# Altium schematic sheet 显示模块.SchDoc: RC1562L
size A4; Organization: 广东工程职业技术学院; Address1: 邹睿燮; Address2: 4****************9; Address3: 1905420313; SheetNumber: 4; SheetTotal: 4
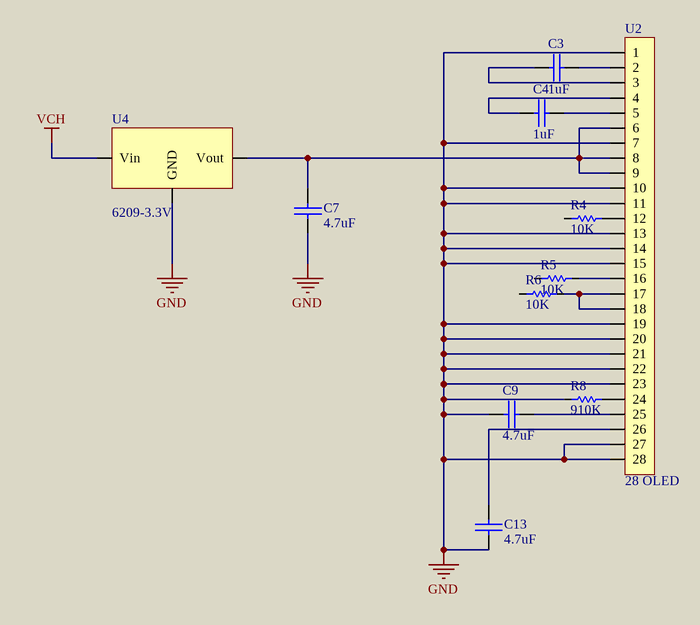
[diagram p0: 显示模块.SchDoc]

## Parts
C3  1uF  [6-0805_L]
C4  1uF  [6-0805_L]
C7  4.7uF  [6-0805_L]
C9  4.7uF  [6-0805_L]
C13  4.7uF  [6-0805_L]
R4  10K  [6-0805_L]
R5  10K  [6-0805_L]
R6  10K  [6-0805_L]
R8  910K  [6-0805_L]
U2  28 OLED  [28OLED]
U4  6209-3.3V  [SOT-23]

## Nets
GND: C7.1 C9.2 C13.2 R8.1 U2.1 U2.7 U2.10 U2.11 U2.13 U2.14 U2.15 U2.19 U2.20 U2.21 U2.22 U2.23 U2.27 U2.28 U4.1(GND)
VCH: U4.3(Vin)
NetC3_1: C3.1 U2.3
NetC3_2: C3.2 U2.2
NetC4_1: C4.1 U2.4
NetC4_2: C4.2 U2.5
NetC7_2: C7.2 U2.6 U2.8 U2.9 U4.2(Vout)
NetC9_1: C9.1 U2.25
NetC13_1: C13.1 U2.26
NetR4_2: R4.2 U2.12
NetR5_2: R5.2 U2.16
NetR6_2: R6.2 U2.17 U2.18
NetR8_2: R8.2 U2.24

Not connected (* = marked no-connect by the designer): R4 1; R5 1; R6 1

## Notes on the sheet
- 单位名称
- 考生信息
- 图名
- 文件名
- 第
- 幅
- 总共
- 当前日期
- 当前时间

## Library data of the parts
C3 C4 C7 C9 C13 = CAP: Capacitor
R4-R6 R8 = Res1_1: Resistor; Published: 8-Jun-2000; LatestRevisionDate: 17-Jul-2002; LatestRevisionNote: Re-released for DXP Platform.; PackageReference: AXIAL-0.3; Publisher: Altium Limited; PackageDescription: Axial Device, Thru-Hole; 2 Leads; 0.3 in Pin Spacing
U2 = 28OLED
U4 = LDO